# Altium schematic sheet SS_SECE_V2.0.SchDoc
size A4
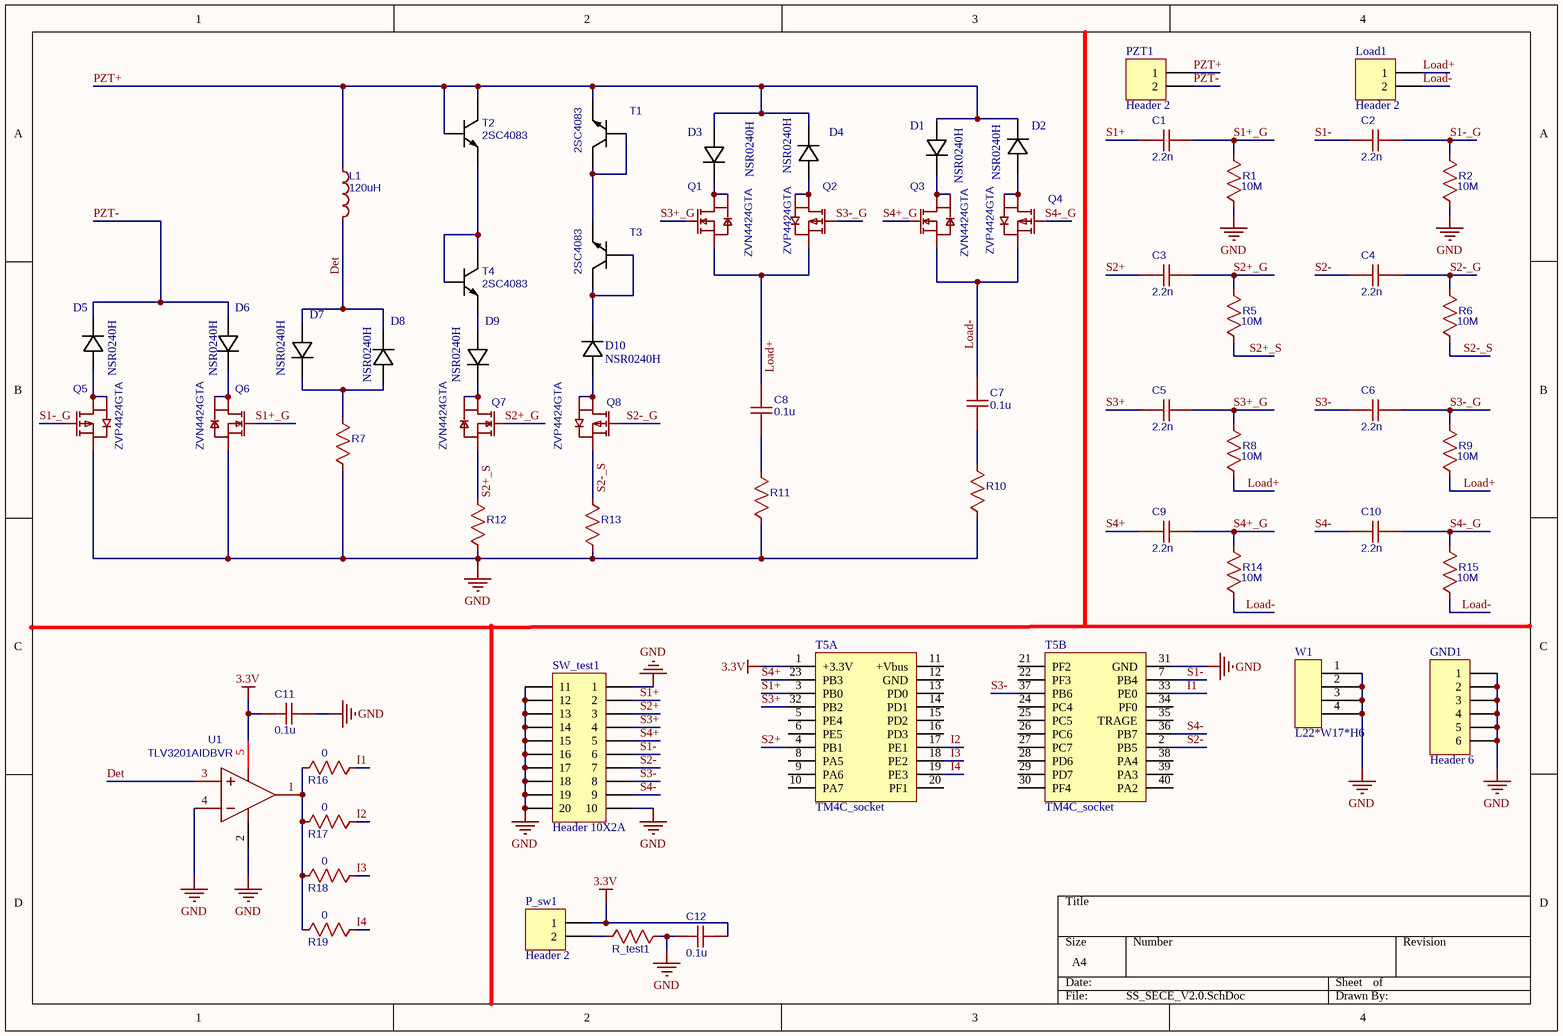
[diagram p0: SS_SECE_V2.0.SchDoc]

## Parts
C1  2.2n  [C0603]
C2  2.2n  [C0603]
C3  2.2n  [C0603]
C4  2.2n  [C0603]
C5  2.2n  [C0603]
C6  2.2n  [C0603]
C7  0.1u  [Cap2220]
C8  0.1u  [Cap2220]
C9  2.2n  [C0603]
C10  2.2n  [C0603]
C11  0.1u  [C0603]
C12  0.1u  [C0603]
D1  NSR0240H  [SOD-323]
D2  NSR0240H  [SOD-323]
D3  NSR0240H  [SOD-323]
D4  NSR0240H  [SOD-323]
D5  NSR0240H  [SOD-323]
D6  NSR0240H  [SOD-323]
D7  NSR0240H  [SOD-323]
D8  NSR0240H  [SOD-323]
D9  NSR0240H  [SOD-323]
D10  NSR0240H  [SOD-323]
GND1  Header 6  [HDR1X6]
L1  120uH  [120uH]
Load1  Header 2  [HDR1X2]
P_sw1  Header 2  [HDR1X2]
PZT1  Header 2  [HDR1X2]
Q1  ZVN4424GTA  [SOT-223-4_L6.5-W3.5-P2.30-LS7.0-BR]
Q2  ZVP4424GTA  [SOT-223-4_L6.5-W3.5-P2.30-LS7.0-BR]
Q3  ZVN4424GTA  [SOT-223-4_L6.5-W3.5-P2.30-LS7.0-BR]
Q4  ZVP4424GTA  [SOT-223-4_L6.5-W3.5-P2.30-LS7.0-BR]
Q5  ZVP4424GTA  [SOT-223-4_L6.5-W3.5-P2.30-LS7.0-BR]
Q6  ZVN4424GTA  [SOT-223-4_L6.5-W3.5-P2.30-LS7.0-BR]
Q7  ZVN4424GTA  [SOT-223-4_L6.5-W3.5-P2.30-LS7.0-BR]
Q8  ZVP4424GTA  [SOT-223-4_L6.5-W3.5-P2.30-LS7.0-BR]
R1  10M  [R0603]
R2  10M  [R0603]
R5  10M  [R0603]
R6  10M  [R0603]
R7  0  [R0603]  (value not drawn)
R8  10M  [R0603]
R9  10M  [R0603]
R10  0  [R0603]  (value not drawn)
R11  0  [R0603]  (value not drawn)
R12  0  [R0603]  (value not drawn)
R13  0  [R0603]  (value not drawn)
R14  10M  [R0603]
R15  10M  [R0603]
R16  0  [R0603]
R17  0  [R0603]
R18  0  [R0603]
R19  0  [R0603]
R_test1  1k  [R0603]  (value not drawn)
SW_test1  Header 10X2A  [HDR2X10_CEN]
T1  2SC4083  [SOT 323]
T2  2SC4083  [SOT 323]
T3  2SC4083  [SOT 323]
T4  2SC4083  [SOT 323]
T5  TM4C_socket  [Tm4c_socket]  (parts A,B of 2)
U1  TLV3201AIDBVR  [SOT-23-5_L3.0-W1.7-P0.95-LS2.8-BR]
W1  L22*W17*H6  [L22*W17*H6]

## Nets
3.3V: C11.1 C12.1 P_sw1.1 T5.1(+3.3V) U1.5(VCC)
GND: C11.2 C12.2 GND1.1 GND1.2 GND1.3 GND1.4 GND1.5 GND1.6 Q5.3(S) Q6.3(S) R1.1 R2.1 R7.1 R10.1 R11.1 R12.1 R13.1 R_test1.2 SW_test1.1 SW_test1.10 SW_test1.11 SW_test1.12 SW_test1.13 SW_test1.14 SW_test1.15 SW_test1.16 SW_test1.17 SW_test1.18 SW_test1.19 SW_test1.20 T5.31(GND) U1.2(GND) U1.4(IN-) W1.1(GND) W1.2 W1.3 W1.4
Det: D7.2(A) D8.1(C) L1.2 U1.3(IN+)
I1: R16.2 T5.33(PE0)
I2: R17.2 T5.17(PE1)
I3: R18.2 T5.18(PE2)
I4: R19.2 T5.19(PE3)
Load+: C8.2 Load1.1 Q1.3(S) Q2.3(S) R8.1 R9.1
Load-: C7.2 Load1.2 Q3.3(S) Q4.3(S) R14.1 R15.1
PZT+: D1.2(A) D2.1(C) D3.2(A) D4.1(C) L1.1 PZT1.1 T1.1(E) T2.2(B) T2.3(C)
PZT-: D5.1(C) D6.2(A) PZT1.2
S1+: C1.1 SW_test1.2 T5.3(PB0)
S1+_G: C1.2 Q6.1(G) R1.2
S1-: C2.1 SW_test1.6 T5.7(PB4)
S1-_G: C2.2 Q5.1(G) R2.2
S2+: C3.1 SW_test1.3 T5.4(PB1)
S2+_G: C3.2 Q7.1(G) R5.2
S2+_S: Q7.3(S) R5.1 R12.2
S2-: C4.1 SW_test1.7 T5.2(PB5)
S2-_G: C4.2 Q8.1(G) R6.2
S2-_S: Q8.3(S) R6.1 R13.2
S3+: C5.1 SW_test1.4 T5.32(PB2)
S3+_G: C5.2 Q1.1(G) R8.2
S3-: C6.1 SW_test1.8 T5.37(PB6)
S3-_G: C6.2 Q2.1(G) R9.2
S4+: C9.1 SW_test1.5 T5.23(PB3)
S4+_G: C9.2 Q3.1(G) R14.2
S4-: C10.1 SW_test1.9 T5.36(PB7)
S4-_G: C10.2 Q4.1(G) R15.2
NetC7_1: C7.1 R10.2
NetC8_1: C8.1 R11.2
NetD1_1: D1.1(C) Q3.2(D) Q3.4(D)
NetD2_2: D2.2(A) Q4.2(D) Q4.4(D)
NetD3_1: D3.1(C) Q1.2(D) Q1.4(D)
NetD4_2: D4.2(A) Q2.2(D) Q2.4(D)
NetD5_2: D5.2(A) Q5.2(D) Q5.4(D)
NetD6_1: D6.1(C) Q6.2(D) Q6.4(D)
NetD7_1: D7.1(C) D8.2(A) R7.2
NetD9_1: D9.1(C) Q7.2(D) Q7.4(D)
NetD9_2: D9.2(A) T4.1(E)
NetD10_1: D10.1(C) T3.2(B) T3.3(C)
NetD10_2: D10.2(A) Q8.2(D) Q8.4(D)
NetP_sw1_2: P_sw1.2 R_test1.1
NetR16_1: R16.1 R17.1 R18.1 R19.1 U1.1(OUT)
NetT1_2: T1.2(B) T1.3(C) T3.1(E)
NetT2_1: T2.1(E) T4.2(B) T4.3(C)

Not connected (* = marked no-connect by the designer): T5 5(PE4) 6(PE5) 8(PA5) 9(PA6) 10(PA7) 11(+Vbus) 12(GND) 13(PD0) 14(PD1) 15(PD2) 16(PD3) 20(PF1) 21(PF2) 22(PF3) 24(PC4) 25(PC5) 26(PC6) 27(PC7) 28(PD6) 29(PD7) 30(PF4) 34(PF0) 35(TRAGE) 38(PA4) 39(PA3) 40(PA2)

## Library data of the parts
C1-C12 = 0.1u: nameAlias: Value(F); Contributor: LCEDA_Lib; spicePre: C; spiceSymbolName: C_0603_US
GND1 = Header 6: Header, 6-Pin; LatestRevisionDate: 17-Jul-2002; LatestRevisionNote: Re-released for DXP Platform.; Publisher: Altium Limited
L1 = 47uH: BOM_Manufacturer: FH; BOM_Manufacturer Part: VLU1012-470KB; nameAlias: Inductance; Contributor: LCSC; BOM_Supplier: LCSC; BOM_Supplier Part: C142466; spicePre: L; spiceSymbolName: VLU1012-470KB
Load1 P_sw1 PZT1 = Header 2: Header, 2-Pin; LatestRevisionDate: 17-Jul-2002; LatestRevisionNote: Re-released for DXP Platform.; Publisher: Altium Limited
Q1 Q3 Q6 Q7 = ZVN4424GTA: BOM_Manufacturer: Diodes Incorporated; BOM_Manufacturer Part: ZVP4424GTA; Contributor: LCSC; BOM_Supplier: LCSC; BOM_Supplier Part: C397967; spicePre: Q; spiceSymbolName: ZVP4424GTA
Q2 Q4 Q5 Q8 = ZVP4424GTA: BOM_Manufacturer: Diodes Incorporated; Contributor: LCSC; BOM_Supplier: LCSC; BOM_Supplier Part: C397967; BOM_Manufacturer Part: ZVP4424GTA; spicePre: Q; spiceSymbolName: ZVP4424GTA
R1 R2 R5-R19 R_test1 = 1k: Contributor: LCEDA_Lib; spicePre: R; spiceSymbolName: R_1206_US
SW_test1 = Header 10X2A: Header, 10-Pin, Dual row; LatestRevisionDate: 17-Jul-2002; LatestRevisionNote: Re-released for DXP Platform.; Publisher: Altium Limited
U1 = TLV3201AIDBVR: BOM_Manufacturer: TI; SMT Type: Extend; BOM_Supplier: LCSC; BOM_Manufacturer Part: TLV3201AIDBVR; BOM_Supplier Part: C105188; BOM_LCSC Assembly: Yes; spicePre: U; spiceSymbolName: TLV3201AIDBVR